# EAGLE design WizFi210_Breakout_Board (EAGLE 6.1)
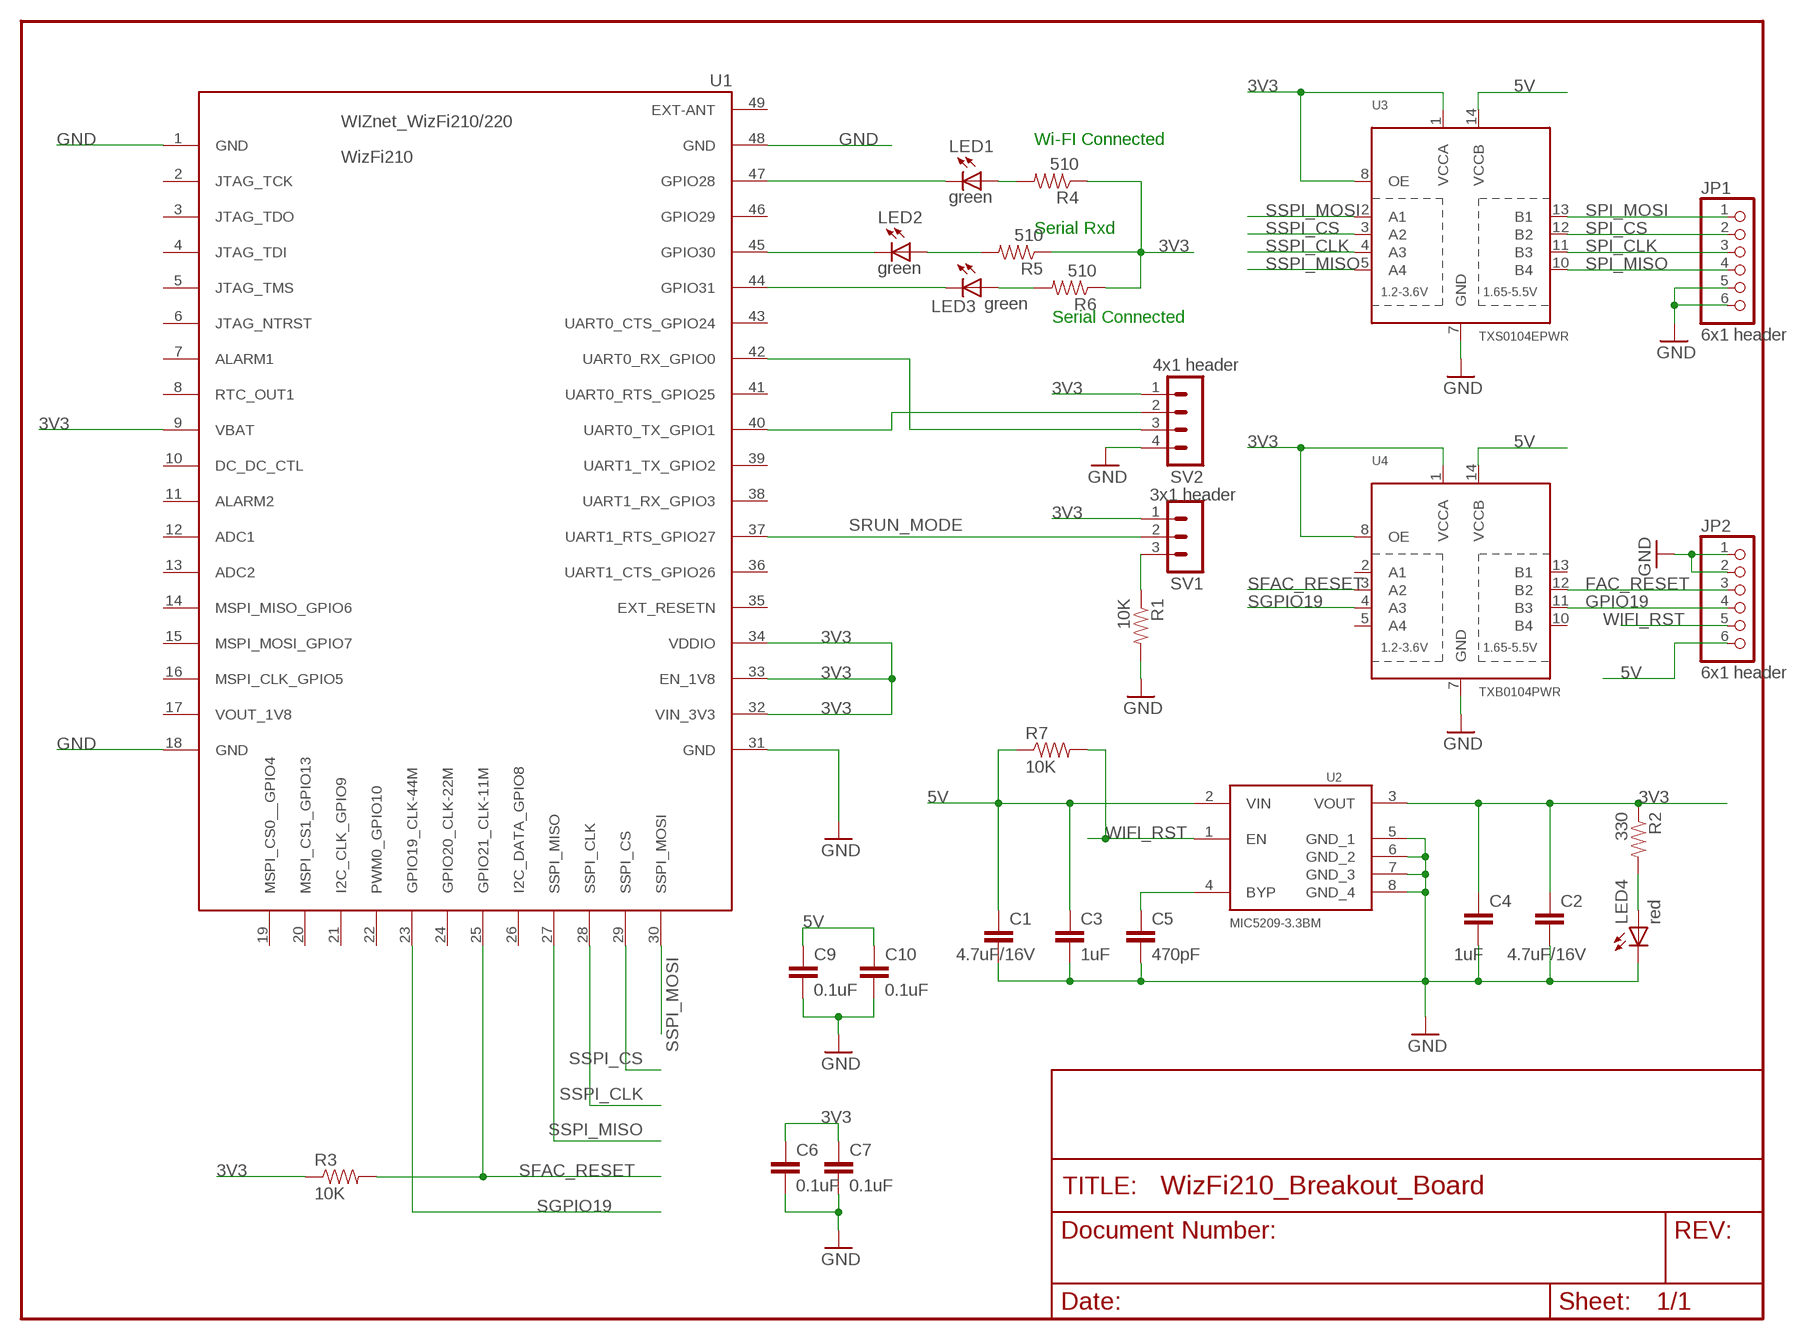
[diagram p0: schematic, sheet 1]

## Parts
C1  4.7uF/16V  C-EUC0805  [C0805]
C2  4.7uF/16V  C-EUC0603  [C0603]
C3  1uF  C-EUC0603  [C0603]
C4  1uF  C-EUC0805  [C0805]
C5  470pF  C-EUC0603  [C0603]
C6  0.1uF  C-EUC0603  [C0603]
C7  0.1uF  C-EUC0603  [C0603]
C9  0.1uF  C-EUC0603  [C0603]
C10  0.1uF  C-EUC0603  [C0603]
JP1  6x1 header  PINHD-1X6  [1X06]
JP2  6x1 header  PINHD-1X6  [1X06]
LED1  green  LEDCHIP-LED0805  [CHIP-LED0805]
LED2  green  LEDCHIP-LED0805  [CHIP-LED0805]
LED3  green  LEDCHIP-LED0805  [CHIP-LED0805]
LED4  red  LEDCHIP-LED0805  [CHIP-LED0805]
R1  10K  RESISTOR0603-RES  [0603-RES]
R2  330  RESISTOR0603-RES  [0603-RES]
R3  10K  RESISTOR0603-RES  [0603-RES]
R4  510  RESISTOR0603-RES  [0603-RES]
R5  510  RESISTOR0603-RES  [0603-RES]
R6  510  RESISTOR0603-RES  [0603-RES]
R7  10K  RESISTOR0603-RES  [0603-RES]
SV1  3x1 header  MA03-1  [MA03-1]
SV2  4x1 header  MA04-1  [MA04-1]
U1  WizFi210  WIZFI210/220  [WIZFI210/220]
U2  MIC5209-3.3BM  MIC5209  [SO08]
U3  TXS0104EPWR  TXB0104PWR  [TSSOP14]
U4  TXB0104PWR  [TSSOP14]

## Nets
3V3: C2.1 C4.1 C6.1 C7.1 R2.1 R3.1 R4.1 R5.1 R6.1 SV1.1 SV2.1 U1.9(VBAT) U1.32(VIN_3V3) U1.33(EN_1V8) U1.34(VDDIO) U2.3(VOUT) U3.1(VCCA) U3.8(OE) U4.1(VCCA) U4.8(OE)
5V: C1.1 C3.1 C9.1 C10.1 JP2.6 R7.1 U2.2(VIN) U3.14(VCCB) U4.14(VCCB)
FAC_RESET: JP2.3 U4.12(B2)
GND: C1.2 C2.2 C3.2 C4.2 C5.2 C6.2 C7.2 C9.2 C10.2 JP1.5 JP1.6 JP2.1 JP2.2 LED4.C R1.2 SV2.4 U1.1(GND) U1.18(GND) U1.31(GND) U1.48(GND) U2.5(GND_1) U2.6(GND_2) U2.7(GND_3) U2.8(GND_4) U3.7(GND) U4.7(GND)
GPIO19: JP2.4 U4.11(B3)
GPIO28: LED1.C U1.47(GPIO28)
GPIO30: LED2.C U1.45(GPIO30)
GPIO31: LED3.C U1.44(GPIO31)
N$1: R1.1 SV1.3
N$2: LED4.A R2.2
N$5: C5.1 U2.4(BYP)
N$50: LED1.A R4.2
N$51: LED2.A R5.2
N$53: LED3.A R6.2
SFAC_RESET: R3.2 U1.25(GPIO21_CLK-11M) U4.3(A2)
SGPIO19: U1.23(GPIO19_CLK-44M) U4.4(A3)
SPI_CLK: JP1.3 U3.11(B3)
SPI_CS: JP1.2 U3.12(B2)
SPI_MISO: JP1.4 U3.10(B4)
SPI_MOSI: JP1.1 U3.13(B1)
SRUN_MODE: SV1.2 U1.37(UART1_RTS_GPIO27)
SSPI_CLK: U1.28(SSPI_CLK) U3.4(A3)
SSPI_CS: U1.29(SSPI_CS) U3.3(A2)
SSPI_MISO: U1.27(SSPI_MISO) U3.5(A4)
SSPI_MOSI: U1.30(SSPI_MOSI) U3.2(A1)
UART0_RX: SV2.3 U1.42(UART0_RX_GPIO0)
UART0_TX: SV2.2 U1.40(UART0_TX_GPIO1)
WIFI_RST: JP2.5 R7.2 U2.1(EN)
Unconnected: U1.2(JTAG_TCK) U1.3(JTAG_TDO) U1.4(JTAG_TDI) U1.5(JTAG_TMS) U1.6(JTAG_NTRST) U1.7(ALARM1) U1.8(RTC_OUT1) U1.10(DC_DC_CTL) U1.11(ALARM2) U1.12(ADC1) U1.13(ADC2) U1.14(MSPI_MISO_GPIO6) U1.15(MSPI_MOSI_GPIO7) U1.16(MSPI_CLK_GPIO5) U1.17(VOUT_1V8) U1.19(MSPI_CS0__GPIO4) U1.20(MSPI_CS1_GPIO13) U1.21(I2C_CLK_GPIO9) U1.22(PWM0_GPIO10) U1.24(GPIO20_CLK-22M) U1.26(I2C_DATA_GPIO8) U1.35(EXT_RESETN) U1.36(UART1_CTS_GPIO26) U1.38(UART1_RX_GPIO3) U1.39(UART1_TX_GPIO2) U1.41(UART0_RTS_GPIO25) U1.43(UART0_CTS_GPIO24) U1.46(GPIO29) U1.49(EXT-ANT) U4.2(A1) U4.5(A4) U4.10(B4) U4.13(B1)

## Notes on the sheet
- Wi-FI Connected
- Serial Rxd
- Serial Connected

## Library data of the parts
C1-C7 C9 C10 = resistor:C-EU: CAPACITOR, European symbol
JP1 JP2 = pinhead:PINHD-1X6: PIN HEADER
LED1-LED4 = adafruit:LED: LED OSRAM: - CHIPLED LG R971, LG N971, LY N971, LG Q971, LY Q971, LO R971, LY R971 LH N974, LH R974 LS Q976, LO Q976, LY Q976 LO Q996 - Hyper CHIPLED LW Q18S LB Q993, LB Q99A, LB R99A - SideLED LS A670, LO A670, LY A670, LG A670, LP A670 LB A673, LV A673, LT A673, LW A673 LH A674 LY A675 LS A676, LA A676, LO A676, LY A676, LW A676 LS A679, LY A679, LG A679 - Hyper Micro SIDELED® LS Y876, LA Y876, LO Y876, LY Y876 LT Y87S - SmartLED LW L88C, LW L88S LB L89C, LB L89S, LG L890 LS L89K, LO L89K, LY L89K LS L896, LA L896, LO L896, LY L896 - TOPLED LS T670, LO T670, LY T670, LG T670, LP T670 LSG T670, LSP T670, LSY T670, LOP T670, LYG T670 LG T671, LOG T671, LSG T671 LB T673, LV T673, LT T673, LW T673 LH T674 LS T676, LA T676, LO T676, LY T676, LB T676, LH T676, LSB T676, LW T676 LB T67C, LV T67C, LT T67C, LS T67K, LO T67K, LY T67K, LW E67C LS E67B, LA E67B, LO E67B, LY E67B, LB E67C, LV E67C, LT E67C LW T67C LS T679, LY T679, LG T679 LS T770, LO T770, LY T770, LG T770, LP T770 LB T773, LV T773, LT T773, LW T773 LH T774 LS E675, LA E675, LY E675, LS T675 LS T776, LA T776, LO T776, LY T776, LB T776 LHGB T686 LT T68C, LB T68C - Hyper Mini TOPLED® LB M676 - Mini TOPLED Santana® LG M470 LS M47K, LO M47K, LY M47K Source: http://www.osram.convergy.de/
R1-R7 = SparkFun:RESISTOR: Resistor Basic schematic elements and footprints for 0603, 1206, and PTH resistors.
SV1 = con-lstb:MA03-1: PIN HEADER; OC_FARNELL: unknown; OC_NEWARK: unknown
SV2 = con-lstb:MA04-1: PIN HEADER; OC_FARNELL: unknown; OC_NEWARK: unknown
U1 = _wiznet_2012-04-17:WIZFI210/220: WIZnet WizFi210 / 220 - Ultra Low Power “Serial to WiFi” Module
U2 = MIC5209:MIC5209
U3 U4 = microbuilder:TXB0104PWR: 4-Bit Bi-Directional Level Shifter 1.2V-3.6V (VCCA) to 1.65V-5.5V (VCCB) bi-directional level shifter with auto direction sensing. Max data rate - VCCA 1.8V: 20Mbps (50ns), VCCA 3.3V: 100Mbps (10ns) Digikey: 296-21929-1-ND

## Board
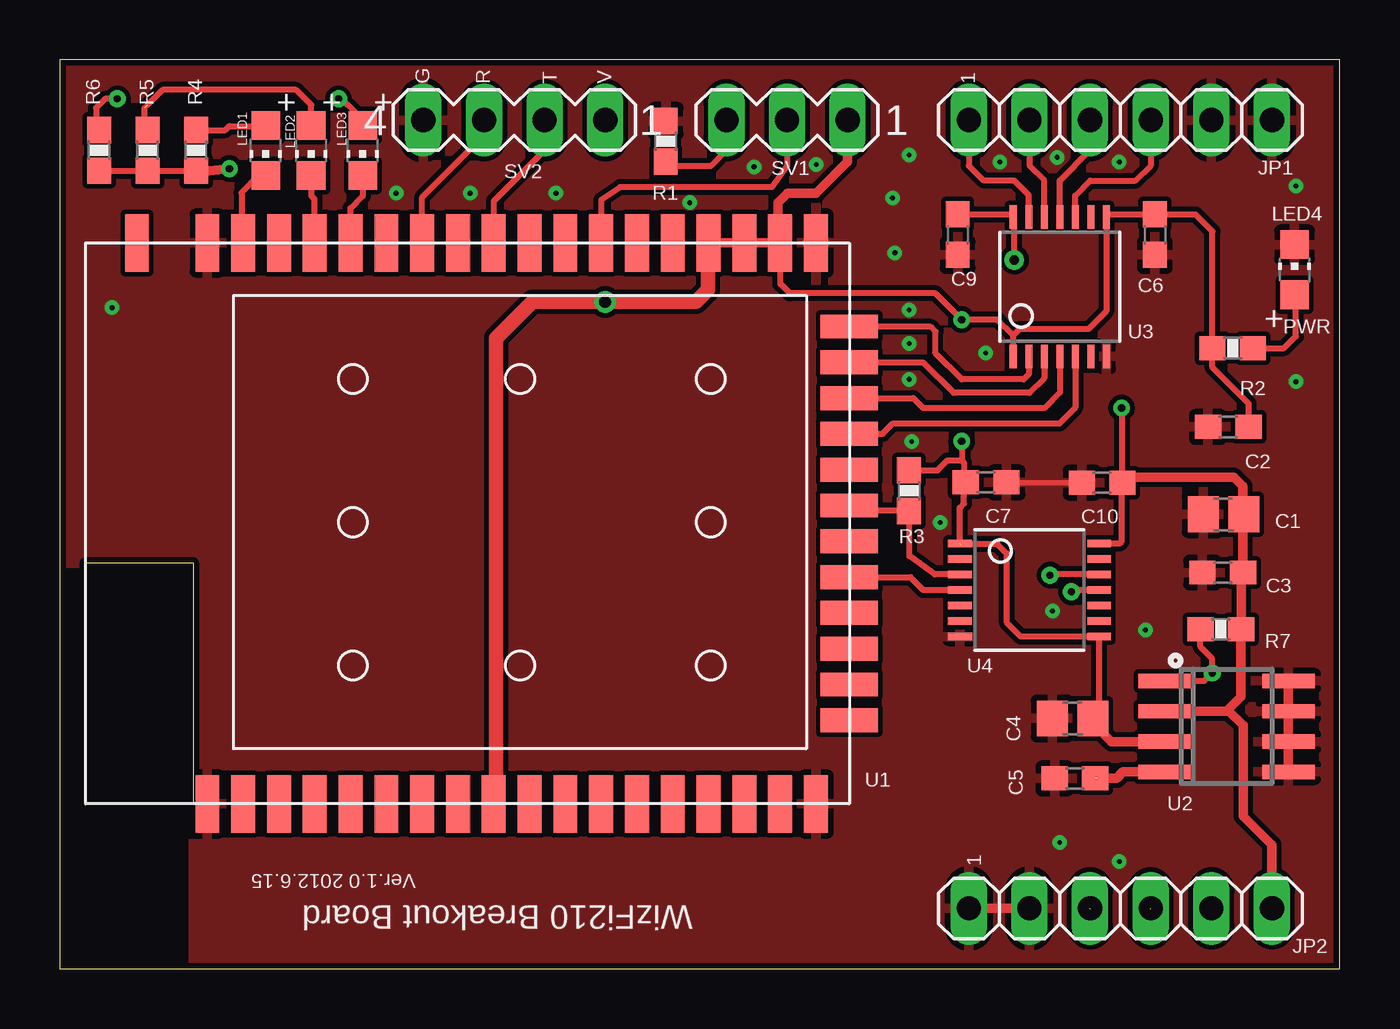
[diagram p1: board, top side]
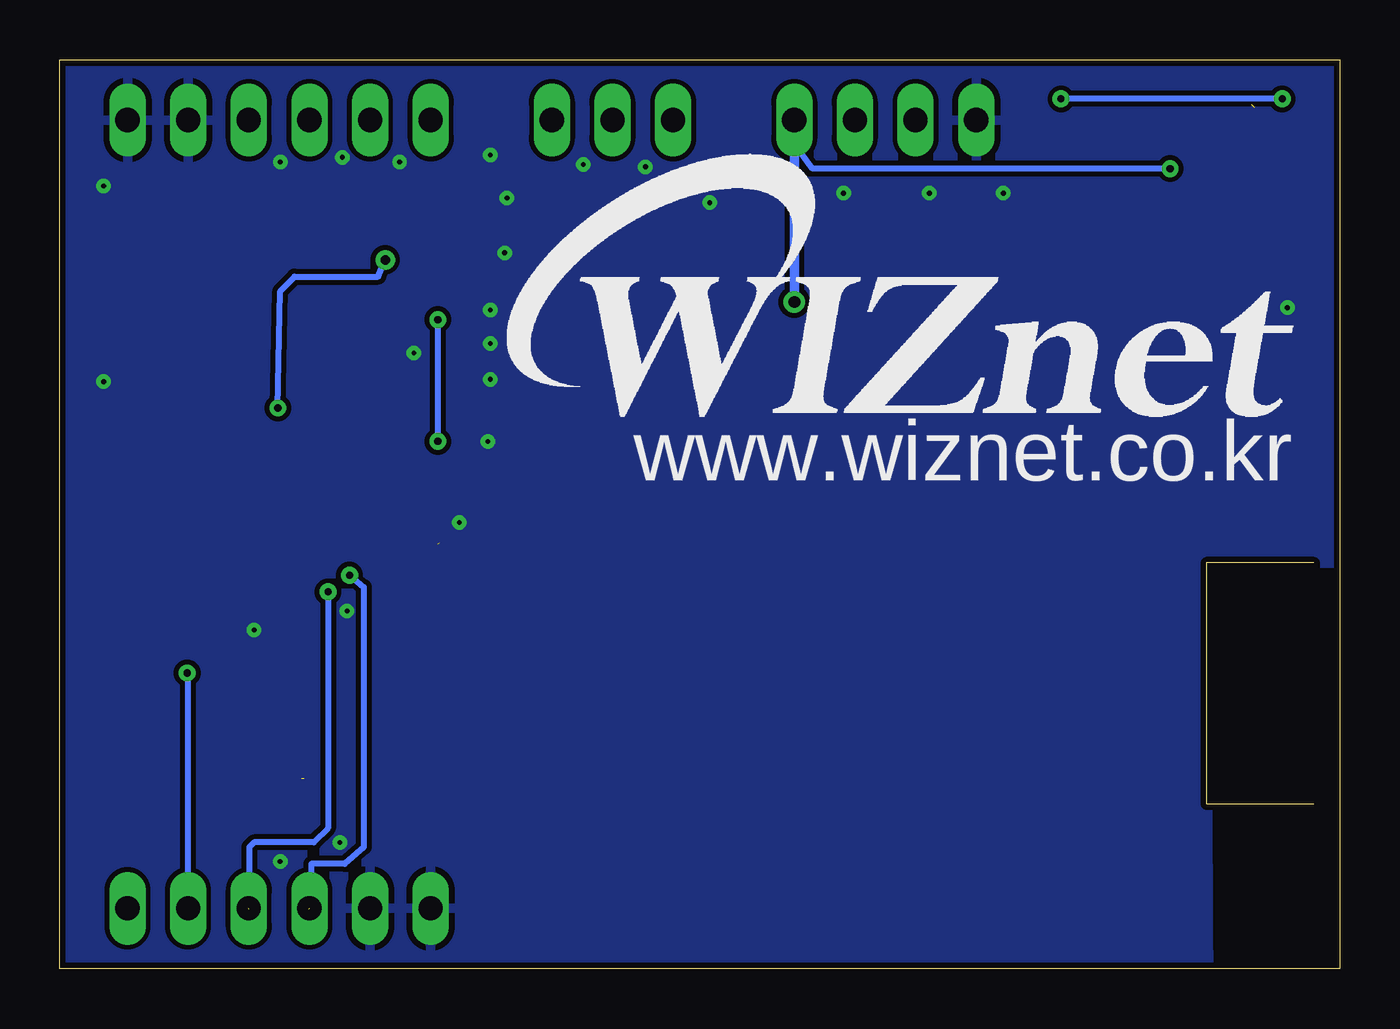
[diagram p2: board, bottom side, seen from below]

Size 53.65 x 38.09 mm. Coordinates in mm from the lower left corner, seen from the top.
Outline: 53.65,0 53.65,38.09 0,38.09 0,0 53.65,0
Copper layers (1*16): Top 0.035mm / dielectric 1.5mm / Bottom 0.035mm
Design rules: minimum track width 10mil, minimum drill 7mil, track to track 8mil, track to pad 8mil, pad to pad 8mil, via to via 8mil, smd to smd 8mil, copper to edge 10mil, drill to drill 8mil, minimum pad ring 10mil, minimum via ring 8mil, stop-mask expansion 4mil, vias tented up to drill 0mil, thermal gap 10mil

### Footprints (pad centres in the part's own frame; a part is rotated, then mirrored left to right if it is on the bottom)
C0805 = smd 1.3 x 1.5: 1 -0.85,0; 2 0.85,0
C0603 = smd 1.1 x 1: 1 -0.85,0; 2 0.85,0
1X06 = drill 1.016 long: 1 -6.35,0; 2 -3.81,0; 3 -1.27,0; 4 1.27,0; 5 3.81,0; 6 6.35,0
CHIP-LED0805 = smd 1.2 x 1.2: A 0,-1.05; C 0,1.05
0603-RES = smd 1.1 x 1: 1 -0.85,0; 2 0.85,0
MA03-1 = drill 1.016 long: 1 -2.54,0; 2 0,0; 3 2.54,0
MA04-1 = drill 1.016 long: 1 -3.81,0; 2 -1.27,0; 3 1.27,0; 4 3.81,0
WIZFI210/220 = smd 2.4 x 1: 1 1.2,28.1; 2 1.2,26.6; 3 1.2,25.1; 4 1.2,23.6; 5 1.2,22.1; 6 1.2,20.6; 7 1.2,19.1; 8 1.2,17.6; 9 1.2,16.1; 10 1.2,14.6; 11 1.2,13.1; 12 1.2,11.6; 13 1.2,10.1; 14 1.2,8.6; 15 1.2,7.1; 16 1.2,5.6; 17 1.2,4.1; 18 1.2,2.6; 31 24.7,2.6; 32 24.7,4.1; 33 24.7,5.6; 34 24.7,7.1; 35 24.7,8.6; 36 24.7,10.1; 37 24.7,11.6; 38 24.7,13.1; 39 24.7,14.6; 40 24.7,16.1; 41 24.7,17.6; 42 24.7,19.1; 43 24.7,20.6; 44 24.7,22.1; 45 24.7,23.6; 46 24.7,25.1; 47 24.7,26.6; 48 24.7,28.1; 49 24.7,31.05 | smd 1 x 2.4: 19 4.7,1.2; 20 6.2,1.2; 21 7.7,1.2; 22 9.2,1.2; 23 10.7,1.2; 24 12.2,1.2; 25 13.7,1.2; 26 15.2,1.2; 27 16.7,1.2; 28 18.2,1.2; 29 19.7,1.2; 30 21.2,1.2
SO08 = smd 0.6 x 2.2: 1 -1.905,-2.6; 2 -0.635,-2.6; 3 0.635,-2.6; 4 1.905,-2.6; 5 1.905,2.6; 6 0.635,2.6; 7 -0.635,2.6; 8 -1.905,2.6
TSSOP14 = smd 0.305 x 0.991: 1 -1.95,-2.918; 2 -1.3,-2.918; 3 -0.65,-2.918; 4 0,-2.918; 5 0.65,-2.918; 6 1.3,-2.918; 7 1.95,-2.918; 8 1.95,2.918; 9 1.3,2.918; 10 0.65,2.918; 11 0,2.918; 12 -0.65,2.918; 13 -1.3,2.918; 14 -1.95,2.918

### Placement (x,y rotation side)
C1  48.77,19.05 180 top
C2  48.97,22.71 180 top
C3  48.73,16.61 180 top
C4  42.45,10.49 180 top
C5  42.55,7.99 180 top
C6  45.89,30.77 270 top
C7  38.82,20.38 0 top
C9  37.63,30.77 270 top
C10  43.68,20.38 180 top
JP1  44.45,35.56 0 top
JP2  44.45,2.54 0 top
LED1  8.64,34.29 180 top
LED2  10.54,34.29 180 top
LED3  12.7,34.29 180 top
LED4  51.75,29.29 0 top
R1  25.4,34.67 90 top
R2  49.15,26 0 top
R3  35.59,20.04 270 top
R4  5.71,34.29 90 top
R5  3.68,34.29 90 top
R6  1.65,34.29 90 top
R7  48.66,14.23 180 top
SV1  30.48,35.56 180 top
SV2  19.05,35.56 180 top
U1  34.29,5.71 90 top
U2  48.9,10.16 270 top
U3  41.91,28.57 0 top
U4  40.64,15.88 270 top
U$1  [WIZNET_LOGO_PAC]  19.7,26.1 0 bottom

### Tracks (layer width: path | path; a pad name or v marks a point on that pad's centre or on a via)
3V3  (via drill 0.3, 0.5)  (1 unrouted)
  Top 0.254: 43.56,10.92 U4.8 40.27,13.93 39.7,14.5 39.7,17.4 39.3,17.8 37.8,17.8 | R6.1 R5.1 R4.1 | C2.1 49.82,23.68 48.3,25.2 R2.1 48.3,30.9 47.6,31.6 45.91,31.6 C6.1 45.72,31.61 45.7,31.6 43.97,31.6 U3.8 43.86,27.56 43.1,26.8 40.22,26.8 39.96,26.54 | U4.1 37.72,19.32 37.9,19.5 37.9,20.31 C7.1 37.9,20.45 37.9,21.2 37.8,21.3 | R3.1 36.79,20.89 37.2,21.3 37.8,21.3 | U3.1 39.96,26.54 | 39.96,26.54 39.3,27.2 v37.8,27.2 36.7,28.3 30.6,28.3 30.2,28.7 U1.32 | v37.8,22.1 37.8,21.3
  Top 0.406: U2.3 44.07,9.53 43.43,10.16 43.43,10.79 C4.1 43.4,10.88 43.43,10.92 43.56,10.92 | 27.18,29.46 27.19,29.48 U1.34 U1.33 U1.32 30.1,30.5 30.1,32.1 30.5,32.5 31.7,32.5 33.02,33.82 SV1.1 | 18.29,7.01 U1.9 | R4.1 6.26,33.44 v7.11,33.53
  Top 0.61: 27.18,29.46 27.18,28.45 26.67,27.94 v22.86,27.94 19.81,27.94 18.29,26.42 18.29,7.01
  Bottom 0.254: v7.11,33.53 22.1,33.53 22.86,34.54 | v37.8,27.2 v37.8,22.1
  Bottom 0.406: SV2.1 22.86,34.54 v22.86,27.94
5V  (via drill 0.3, 0.4)
  Top 0.254: U4.14 44.42,17.82 44.5,17.9 44.5,20.34 C10.1 | C10.1 44.53,23.47 v44.5,23.5 | v40,29.7 40,31.5 | 40,31.5 40,31.6 37.65,31.6 C9.1 | U3.14 39.99,31.49 40,31.5 | C10.1 44.53,20.47 44.5,20.5 | 49.51,16.61 C3.1
  Top 0.406: JP2.6 50.8,5.2 49.6,6.4 49.6,10.2 49,10.8 U2.2 48.9,10.79 49.5,11.4 R7.1 49.51,16.61 49.6,16.7 | C3.1 49.59,19.01 | 49.59,19.01 C1.1 | 49.59,19.01 49.59,20.21 49.2,20.6 44.6,20.6 44.5,20.5
  Bottom 0.254: v44.5,23.5 44.4,28.4 43.8,29 40.3,29 v40,29.7
FAC_RESET  (via drill 0.3)  (1 unrouted)
  Top 0.254: U4.12 41.52,16.52 v41.5,16.5
  Bottom 0.254: v41.5,16.5 40.9,16 40.9,5.1 41.7,4.4 43.1,4.4 43.1,2.6 43.2,2.5
GND  (via drill 0.2)
  Top 0.254: C7.2 C10.2
  Top 0.406: U2.7 U2.6 U2.5 | U2.7 51.49,12.01 51.44,12.06 | U2.7 U2.8 | R1.2 25.4,35.5 | JP2.1 JP2.2
  other vias: 51.8,32.8 51.8,24.6 35,30 20.8,32.5 29.1,33.6 31.7,33.7 14.1,32.5 2.2,27.7 17.2,32.5 26.4,32.1 38.8,25.8 34.9,32.3 35.6,34.1 45.5,14.2 35.7,22.1 36.9,18.7 35.6,24.7 35.6,26.2 35.6,27.6 41.6,15 41.9,5.3 44.4,33.8 39.4,33.8 41.8,34 44.4,4.5
  pour Top: -0.6,38.8 -0.6,17 5.6,17 5.6,16.9 5.6,-0.9 54.5,-0.9 54.5,39 -0.6,39
  pour Bottom: -0.6,39 -0.7,17 5.6,17 5.5,-1 54.6,-0.9 54.6,39.1 -0.5,38.8
GPIO19  (via drill 0.3)  (1 unrouted)
  Top 0.254: U4.11 42.4,15.88 v42.4,15.8
  Bottom 0.254: v42.4,15.8 42.4,5.9 43,5.3 45.5,5.3 45.7,5.1 45.7,2.5
GPIO28
  Top 0.254: 8.35,33.24 7.62,32.51 7.62,30.73
  Top 0.406: U1.47 7.87,30.41 7.87,30.48 7.62,30.73 | LED1.C 8.35,33.24
GPIO30
  Top 0.254: LED2.C 10.54,32.38 10.67,32.26 10.67,30.44
  Top 0.406: 10.67,30.44 U1.45
GPIO31
  Top 0.254: U1.44 12.19,31.88 12.7,32.38 LED3.C
  Top 0.406: 12.48,33.02 LED3.C
N$1
  Top 0.254: SV1.3 27.94,34.29 27.3,33.66 25.4,33.66
  Top 0.406: R1.1 25.4,33.66
N$2
  Top 0.254: R2.2 51.3,26 51.8,26.5 51.8,28.19 LED4.A
N$5  (1 unrouted)
  Top 0.254: 43.5,8 43.4,8.1
  Top 0.406: U2.4 44.55,8.26 44.3,8 43.5,8
N$50
  Top 0.254: R4.2 6.95,35.14 7.11,35.31 8.38,35.31
  Top 0.406: LED1.A 8.42,35.34 8.38,35.31
N$51  (1 unrouted)
  Top 0.254: 3.68,36.2 4.32,36.83 9.91,36.83 10.54,36.2 LED2.A | 3.56,35.14 3.56,36.07
  Top 0.406: R5.2 3.56,35.14
N$53  (via drill 0.3)
  Top 0.254: LED3.A 12.7,35.56 12.06,36.2 v11.68,36.45 | v2.41,36.45 1.91,36.45 1.52,36.07 1.52,35.27
  Top 0.406: 1.52,35.27 R6.2
  Bottom 0.254: v2.41,36.45 v11.68,36.45
SFAC_RESET
  Top 0.254: U4.3 36.67,16.52 35.6,17.3 R3.2 33.32,19.19 U1.25
SGPIO19
  Top 0.254: U1.23 35.66,16.41 36.2,15.88 U4.4
SPI_CLK
  Top 0.254: JP1.3 43.18,34.29 41.91,33.02 U3.11
SPI_CS
  Top 0.254: JP1.2 40.64,33.66 41.26,33.03 U3.12
SPI_MISO
  Top 0.254: JP1.4 45.72,33.66 45.09,33.02 43.18,33.02 42.56,32.4 U3.10
SPI_MOSI
  Top 0.254: JP1.1 38.1,33.66 38.73,33.02 40.01,33.02 40.61,32.41 U3.13
SRUN_MODE
  Top 0.254: SV1.2 30.48,33.66 29.84,32.77 23.5,32.77 22.69,32.22 U1.37
SSPI_CLK
  Top 0.254: U3.4 41.91,24.13 41.27,23.5 36.2,23.5 35.77,23.91 U1.28
SSPI_CS
  Top 0.254: U3.3 41.26,24.75 40.64,24.13 37.47,24.13 36.2,25.4 33.02,25.4
  Top 0.406: 33.02,25.4 33.03,25.41 U1.29
SSPI_MISO
  Top 0.254: U3.5 42.56,23.51 41.91,22.86 34.92,22.86 34.48,22.41 U1.27
SSPI_MOSI
  Top 0.254: U3.2 40.61,24.91 40.4,24.7 37.8,24.7 36.7,25.8 36.7,26.7 36.5,26.9 33.1,26.9 U1.30
UART0_RX
  Top 0.254: SV2.3 17.78,34.92 15.19,32.34 U1.42
UART0_TX
  Top 0.254: SV2.2 20.32,34.29 18.19,32.16 U1.40
WIFI_RST  (via drill 0.3)
  Top 0.254: R7.2 47.8,13.5 48.3,13 v48.3,12.4 47.97,12.06 U2.1
  Bottom 0.254: JP2.5 48.26,12.36 v48.3,12.4

### Text on the board
bPlace: www.wiznet.co.kr
tNames: G | R | T | V | 1 | PWR | Ver.1.0 2012.6.15 | 1 | WizFi210 Breakout Board